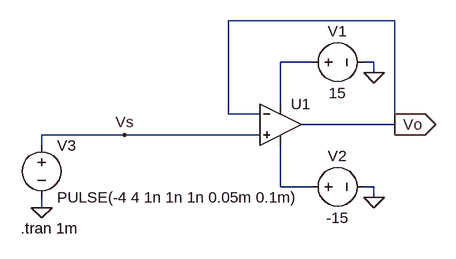
[diagram p0: schematic Run_3_A.asc]
Run_3_A.asc, the LTspice schematic file:
Version 4
SHEET 1 880 680
WIRE 432 -32 176 -32
WIRE 304 32 256 32
WIRE 400 32 384 32
WIRE 400 48 400 32
WIRE 256 96 256 32
WIRE 176 112 176 -32
WIRE 224 112 176 112
WIRE 432 128 432 -32
WIRE 432 128 288 128
WIRE 16 144 -112 144
WIRE 224 144 16 144
WIRE -112 160 -112 144
WIRE 256 224 256 160
WIRE 304 224 256 224
WIRE 400 224 384 224
WIRE 400 240 400 224
WIRE -112 256 -112 240
FLAG 400 48 0
FLAG 400 240 0
FLAG -112 256 0
FLAG 432 128 Vo
IOPIN 432 128 Out
FLAG 16 144 Vs
SYMBOL OpAmps\\UniversalOpamp2 256 128 R0
SYMATTR InstName U1
SYMBOL voltage 288 32 R270
WINDOW 0 32 56 VTop 2
WINDOW 3 -32 56 VBottom 2
WINDOW 123 0 0 Left 0
WINDOW 39 0 0 Left 0
SYMATTR InstName V1
SYMATTR Value 15
SYMBOL voltage 288 224 R270
WINDOW 0 32 56 VTop 2
WINDOW 3 -32 56 VBottom 2
WINDOW 123 0 0 Left 0
WINDOW 39 0 0 Left 0
SYMATTR InstName V2
SYMATTR Value -15
SYMBOL voltage -112 144 R0
WINDOW 123 0 0 Left 0
WINDOW 39 0 0 Left 0
SYMATTR InstName V3
SYMATTR Value PULSE(-4 4 1n 1n 1n 0.05m 0.1m)
TEXT -144 288 Left 2 !.tran 1m

The netlist it stands for:
* Run_3_A.asc
XU1 Vs Vo N001 N002 Vo level.2 Avol=1Meg GBW=10Meg Slew=10Meg ilimit=25m rail=0 Vos=0 phimargin=45 en=0 enk=0 in=0 ink=0 Rin=500Meg  ; pins IN+ IN- V+ V- OUT
V1 N001 0 15
V2 N002 0 -15
V3 Vs 0 PULSE(-4 4 1n 1n 1n 0.05m 0.1m)
.tran 1m
.lib UniversalOpamps2.sub
.backanno
.end